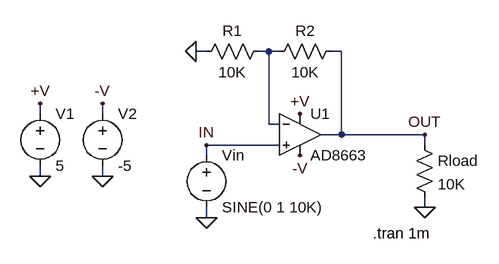
[diagram p0: schematic AD8663.asc]
AD8663.asc, the LTspice schematic file:
Version 4
SHEET 1 1240 700
WIRE 288 -1152 272 -1152
WIRE 384 -1152 368 -1152
WIRE 400 -1152 384 -1152
WIRE 496 -1152 480 -1152
WIRE 32 -1056 32 -1072
WIRE 128 -1056 128 -1072
WIRE 384 -1040 384 -1152
WIRE 400 -1040 384 -1040
WIRE 496 -1024 496 -1152
WIRE 496 -1024 464 -1024
WIRE 624 -1024 496 -1024
WIRE 400 -1008 288 -1008
WIRE 624 -1008 624 -1024
WIRE 288 -992 288 -1008
WIRE 32 -960 32 -976
WIRE 128 -960 128 -976
WIRE 624 -912 624 -928
WIRE 288 -896 288 -912
FLAG 32 -1072 +V
FLAG 32 -960 0
FLAG 288 -896 0
FLAG 624 -1024 OUT
FLAG 288 -1008 IN
FLAG 432 -1056 +V
FLAG 128 -1072 -V
FLAG 432 -992 -V
FLAG 272 -1152 0
FLAG 624 -912 0
FLAG 128 -960 0
SYMBOL Opamps\\AD8663 432 -1088 R0
SYMATTR InstName U1
SYMBOL voltage 32 -1072 R0
WINDOW 123 0 0 Left 2
WINDOW 39 0 0 Left 2
SYMATTR InstName V1
SYMATTR Value 5
SYMBOL voltage 288 -1008 R0
WINDOW 123 24 146 Left 2
WINDOW 39 24 125 Left 2
SYMATTR InstName Vin
SYMATTR Value SINE(0 1 10K)
SYMBOL res 384 -1168 R90
WINDOW 0 0 56 VBottom 2
WINDOW 3 32 56 VTop 2
SYMATTR InstName R1
SYMATTR Value 10K
SYMBOL res 496 -1168 R90
WINDOW 0 0 56 VBottom 2
WINDOW 3 32 56 VTop 2
SYMATTR InstName R2
SYMATTR Value 10K
SYMBOL voltage 128 -1072 R0
WINDOW 123 24 146 Left 2
WINDOW 39 24 125 Left 2
SYMATTR InstName V2
SYMATTR Value -5
SYMBOL res 608 -1024 R0
SYMATTR InstName Rload
SYMATTR Value 10K
TEXT 544 -872 Left 2 !.tran 1m

The netlist it stands for:
* AD8663.asc
XU1 IN N001 +V -V OUT AD8663  ; pins In+ In- V+ V- OUT
V1 +V 0 5
Vin IN 0 SINE(0 1 10K)
R1 N001 0 10K
R2 OUT N001 10K
V2 -V 0 -5
Rload OUT 0 10K
.tran 1m
.backanno
.end